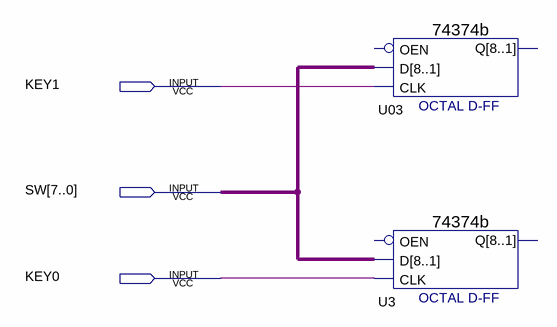
[diagram p0: schematic sheet]
// Quartus schematic bin_adder.bdf as structural Verilog: 2 symbols, 3 pins
module bin_adder (
  input  KEY1,
  input  [7:0] SW,
  input  KEY0
);

  \74374b  U03 (.D(SW), .CLK(KEY1));  // open: OEN, Q
  \74374b  U3 (.D(SW), .CLK(KEY0));  // open: OEN, Q
endmodule
